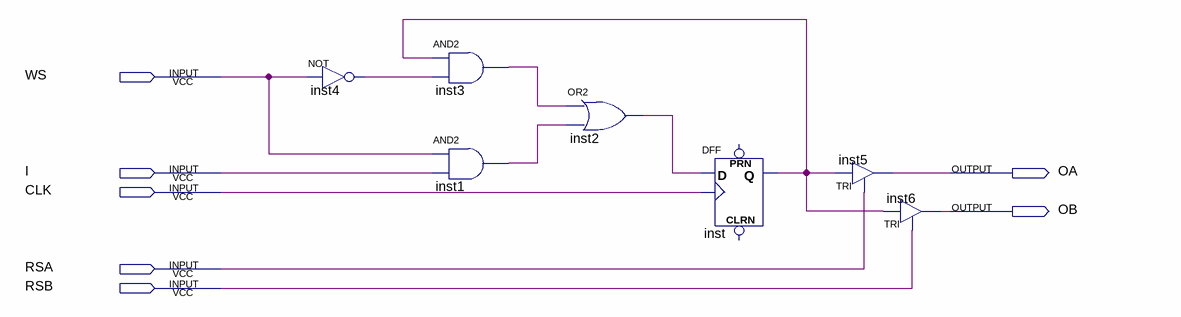
[diagram p0: schematic sheet]
// Quartus schematic RFC.bdf as structural Verilog: 7 symbols, 7 pins
module RFC (
  input  WS,
  input  I,
  input  CLK,
  input  RSA,
  input  RSB,
  output OA,
  output OB
);

  wire inst1_out, inst2_out, inst3_out, inst4_out, inst_q;

  not inst4 (inst4_out, WS);
  and inst3 (inst3_out, inst_q, inst4_out);
  and inst1 (inst1_out, WS, I);
  or inst2 (inst2_out, inst3_out, inst1_out);
  DFF inst (.CLK(CLK), .D(inst2_out), .Q(inst_q));  // open: CLRN, PRN
  TRI inst5 (.IN(inst_q), .OE(RSA), .OUT(OA));
  TRI inst6 (.IN(inst_q), .OE(RSB), .OUT(OB));
endmodule
